# EAGLE design OXO (EAGLE 9.6.2)
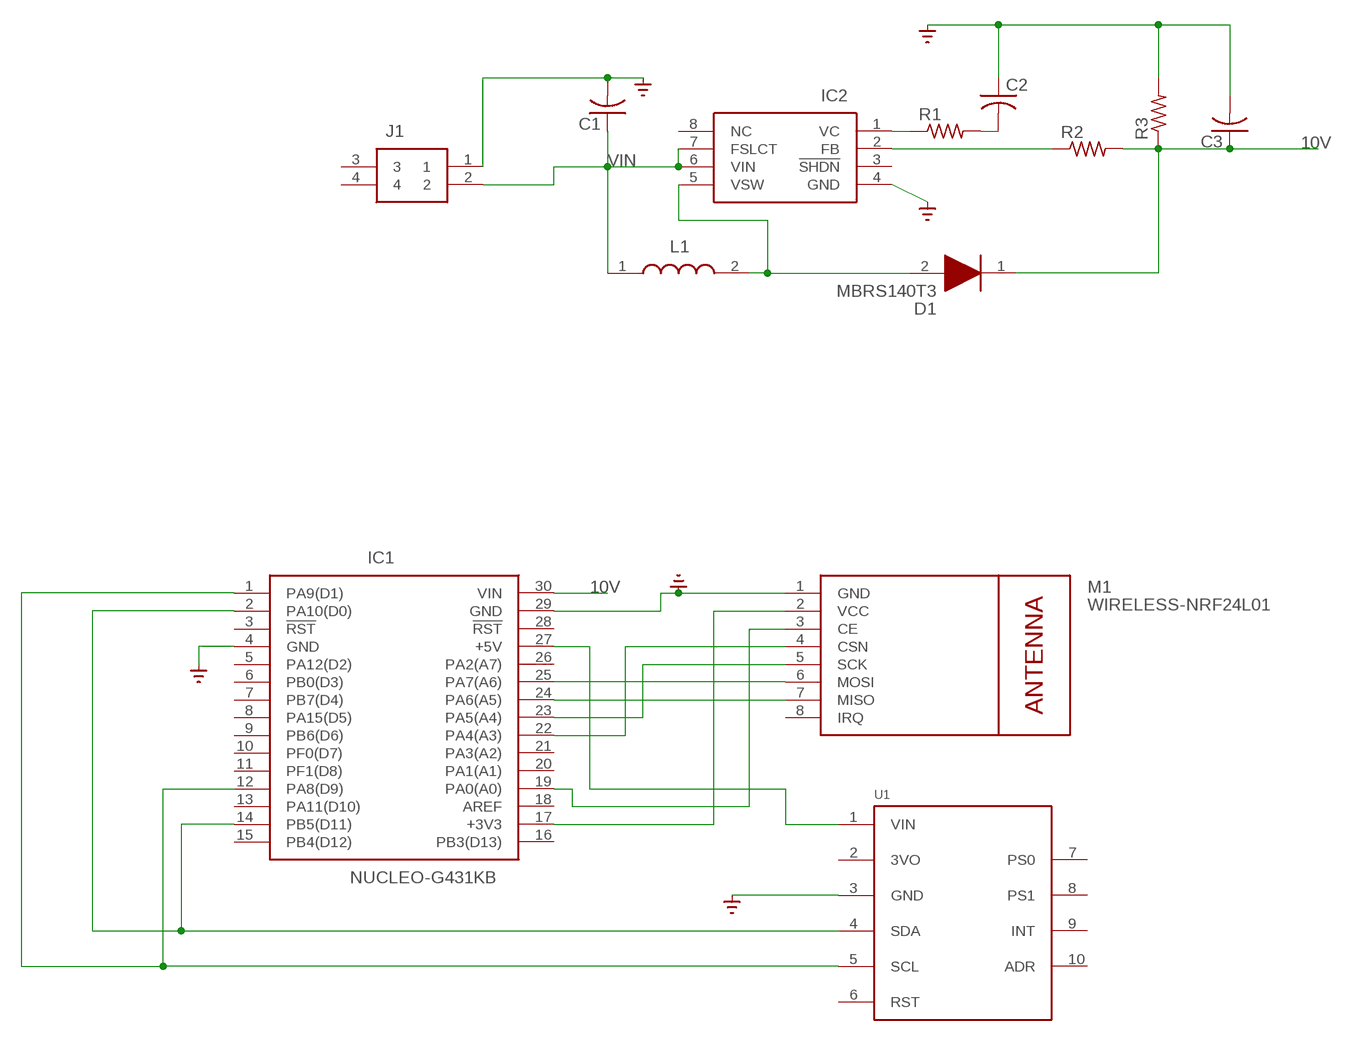
[diagram p0: schematic, sheet 1]

## Parts
C1  C-USC1206  [C1206]
C2  C-USC1206  [C1206]
C3  C-USC1206  [C1206]
D1  MBRS140T3  [DIOM5436X247N]
IC1  NUCLEO-G431KB  [DIPS1524W66P254L5029H1500Q30N]
IC2  LM2698MM-ADJ_NOPB  [SOP65P490X110-8N]
J1  53398-0271  [533980271]
L1  LQH3NPN100MMEL  [LQH3NPN100MMEL]
M1  WIRELESS-NRF24L01  [WIRELESS-NRF24L01]
R1  R-US_R1206  [R1206]
R2  R-US_R1206  [R1206]
R3  R-US_R1206  [R1206]
U1  ADADRUIT-BNO055  [ADAFRUIT-BNO055]

## Nets
10V: C3.1 D1.1(K) IC1.30(VIN) R2.2 R3.1
GND: C1.2 C2.1 C3.2 IC1.4(GND) IC1.29(GND) IC2.4(GND) J1.1 M1.1(GND) R3.2 U1.3(GND) ; supply symbol labelled SUPPLY0_GND_
N$2: IC1.17(+3V3) M1.2(VCC)
N$3: IC1.22(PA4(A3)) M1.4(CSN)
N$4: IC1.23(PA5(A4)) M1.5(SCK)
N$5: IC1.24(PA6(A5)) M1.7(MISO)
N$6: IC1.25(PA7(A6)) M1.6(MOSI)
N$7: IC1.27(+5V) U1.1(VIN)
N$10: IC1.1(PA9(D1)) IC1.12(PA8(D9)) U1.5(SCL)
N$11: IC1.2(PA10(D0)) IC1.14(PB5(D11)) U1.4(SDA)
N$12: IC1.19(PA0(A0)) M1.3(CE)
N$14: IC2.1(VC) R1.1
N$15: C2.2 R1.2
N$16: IC2.2(FB) R2.1
N$18: D1.2(A) IC2.5(VSW) L1.2
VIN: C1.1 IC2.6(VIN) IC2.7(FSLCT) J1.2 L1.1
Unconnected: IC1.3(!RST) IC1.5(PA12(D2)) IC1.6(PB0(D3)) IC1.7(PB7(D4)) IC1.8(PA15(D5)) IC1.9(PB6(D6)) IC1.10(PF0(D7)) IC1.11(PF1(D8)) IC1.13(PA11(D10)) IC1.15(PB4(D12)) IC1.16(PB3(D13)) IC1.18(AREF) IC1.20(PA1(A1)) IC1.21(PA3(A2)) IC1.26(PA2(A7)) IC1.28(!RST) IC2.3(!SHDN) IC2.8(NC) J1.3 J1.4 M1.8(IRQ) U1.6(RST) U1.7(PS0) U1.8(PS1) U1.9(INT) U1.10(ADR)

## Power pins joined to a net without a drawn wire
3VO: U1.2(3VO)

## Library data of the parts
C1-C3 = adafruit:C-US: CAPACITOR, American symbol
D1 = SamacSys_Parts2:MBRS140T3: Schottky Diodes & Rectifiers 1A 40V Source: Datasheet <https://componentsearchengine.com/Datasheets/1/MBRS140T3G.pdf>; DESCRIPTION: Schottky Diodes & Rectifiers 1A 40V; HEIGHT: 2.47mm; MANUFACTURER_NAME: ON Semiconductor; MANUFACTURER_PART_NUMBER: MBRS140T3; MOUSER_PART_NUMBER: 863-MBRS140T3; MOUSER_PRICE-STOCK: https://www.mouser.co.uk/ProductDetail/ON-Semiconductor/MBRS140T3?qs=3JMERSakebr8TMJvlb5wHg%3D%3D
IC1 = NUCLEO-G431KB:NUCLEO-G431KB: STM32 Nucleo-32 development board Source: Datasheet <http://www.st.com/content/ccc/resource/technical/document/data_brief/b1/d8/13/d4/b0/b7/4b/6e/DM00214578.pdf/files/DM00214578.pdf/jcr:content/translations/en.DM00214578.pdf>; ARROW_PART_NUMBER: NUCLEO-F303K8; ARROW_PRICE-STOCK: https://www.arrow.com/en/products/nucleo-f303k8/stmicroelectronics; DESCRIPTION: STM32 Nucleo-32 development board; HEIGHT: 15mm; MANUFACTURER_NAME: STMicroelectronics; MANUFACTURER_PART_NUMBER: NUCLEO-F303K8; RS_PART_NUMBER: 9092862; RS_PRICE-STOCK: http://uk.rs-online.com/web/p/products/9092862
IC2 = SamacSys_Parts2:LM2698MM-ADJ_NOPB: SIMPLE SWITCHER® 1.35A Boost Regulator Source: Datasheet <http://www.ti.com/lit/ds/symlink/lm2698.pdf>; ARROW_PART_NUMBER: LM2698MM-ADJ/NOPB; ARROW_PRICE-STOCK: https://www.arrow.com/en/products/lm2698mm-adjnopb/texas-instruments; DESCRIPTION: SIMPLE SWITCHER&#174; 1.35A Boost Regulator; HEIGHT: 1.1mm; MANUFACTURER_NAME: Texas Instruments; MANUFACTURER_PART_NUMBER: LM2698MM-ADJ/NOPB; MOUSER_PART_NUMBER: 926-LM2698MM-ADJNOPB; MOUSER_PRICE-STOCK: https://www.mouser.co.uk/ProductDetail/Texas-Instruments/LM2698MM-ADJ-NOPB?qs=X1J7HmVL2ZGrlnasHzxFGA%3D%3D
J1 = SamacSys_Parts2:53398-0271: 2 way straight SMT header,1.25mm pitch Molex PICOBLADE Series, Series Number 53398, 1.25mm Pitch 2 Way 1 Row Straight PCB Header, Solder Termination, 1A Source: Datasheet <http://www.molex.com/webdocs/datasheets/pdf/en-us//0533980271_PCB_HEADERS.pdf>; ARROW_PART_NUMBER: 53398-0271; ARROW_PRICE-STOCK: https://www.arrow.com/en/products/53398-0271/molex; DESCRIPTION: 2 way straight SMT header,1.25mm pitch Molex PICOBLADE Series, Series Number 53398, 1.25mm Pitch 2 Way 1 Row Straight PCB Header, Solder Termination, 1A; HEIGHT: 4.9mm; MANUFACTURER_NAME: Molex; MANUFACTURER_PART_NUMBER: 53398-0271; MOUSER_PART_NUMBER: 538-53398-0271; MOUSER_PRICE-STOCK: https://www.mouser.co.uk/ProductDetail/Molex/53398-0271?qs=yqtfsgZKt1Q75bA%252B4OtvRg%3D%3D
L1 = SamacSys_Parts2:LQH3NPN100MMEL: Fixed Inductors 10uH 1280mA 0.228ohm SRF=20MHz(min) Source: Datasheet <https://psearch.en.murata.com/inductor/product/LQH3NPN100MME#.html>; ARROW_PART_NUMBER: LQH3NPN100MMEL; ARROW_PRICE-STOCK: https://www.arrow.com/en/products/lqh3npn100mmel/murata-manufacturing; DESCRIPTION: Fixed Inductors 10uH 1280mA 0.228ohm SRF=20MHz(min); HEIGHT: 1.5mm; MANUFACTURER_NAME: Murata Electronics; MANUFACTURER_PART_NUMBER: LQH3NPN100MMEL; MOUSER_PART_NUMBER: 81-LQH3NPN100MMEL; MOUSER_PRICE-STOCK: https://www.mouser.co.uk/ProductDetail/Murata-Electronics/LQH3NPN100MMEL?qs=sJ5gq5MLFXowmwE0TDL8SQ%3D%3D
M1 = diy-modules:WIRELESS-NRF24L01: 2.4 GHz Wireless Module based on NRF24L01 chip More details available here: http://www.electrodragon.com/w/NRF24L01 Click here to find device on ebay.com <http://www.ebay.com/sch/nrf24l01+arduino>
R1-R3 = resistor:R-US_: RESISTOR, American symbol
U1 = BNO055:ADADRUIT-BNO055

## Board
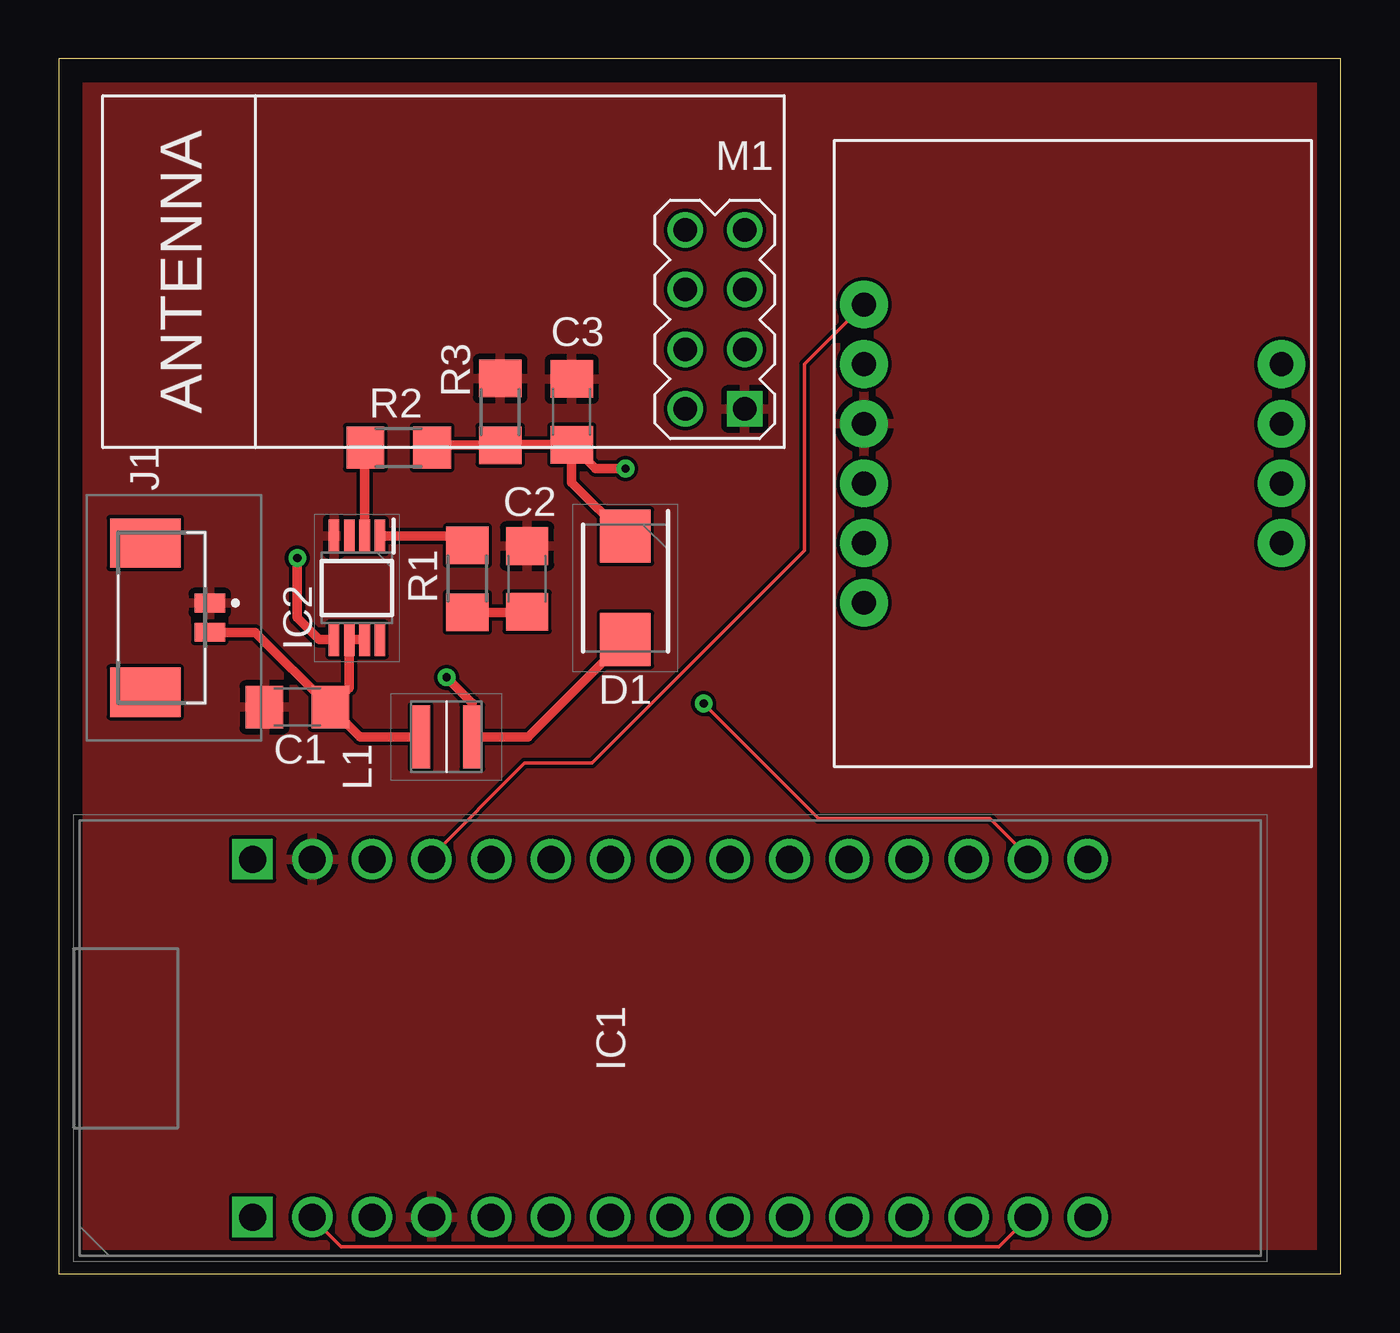
[diagram p1: board, top side]
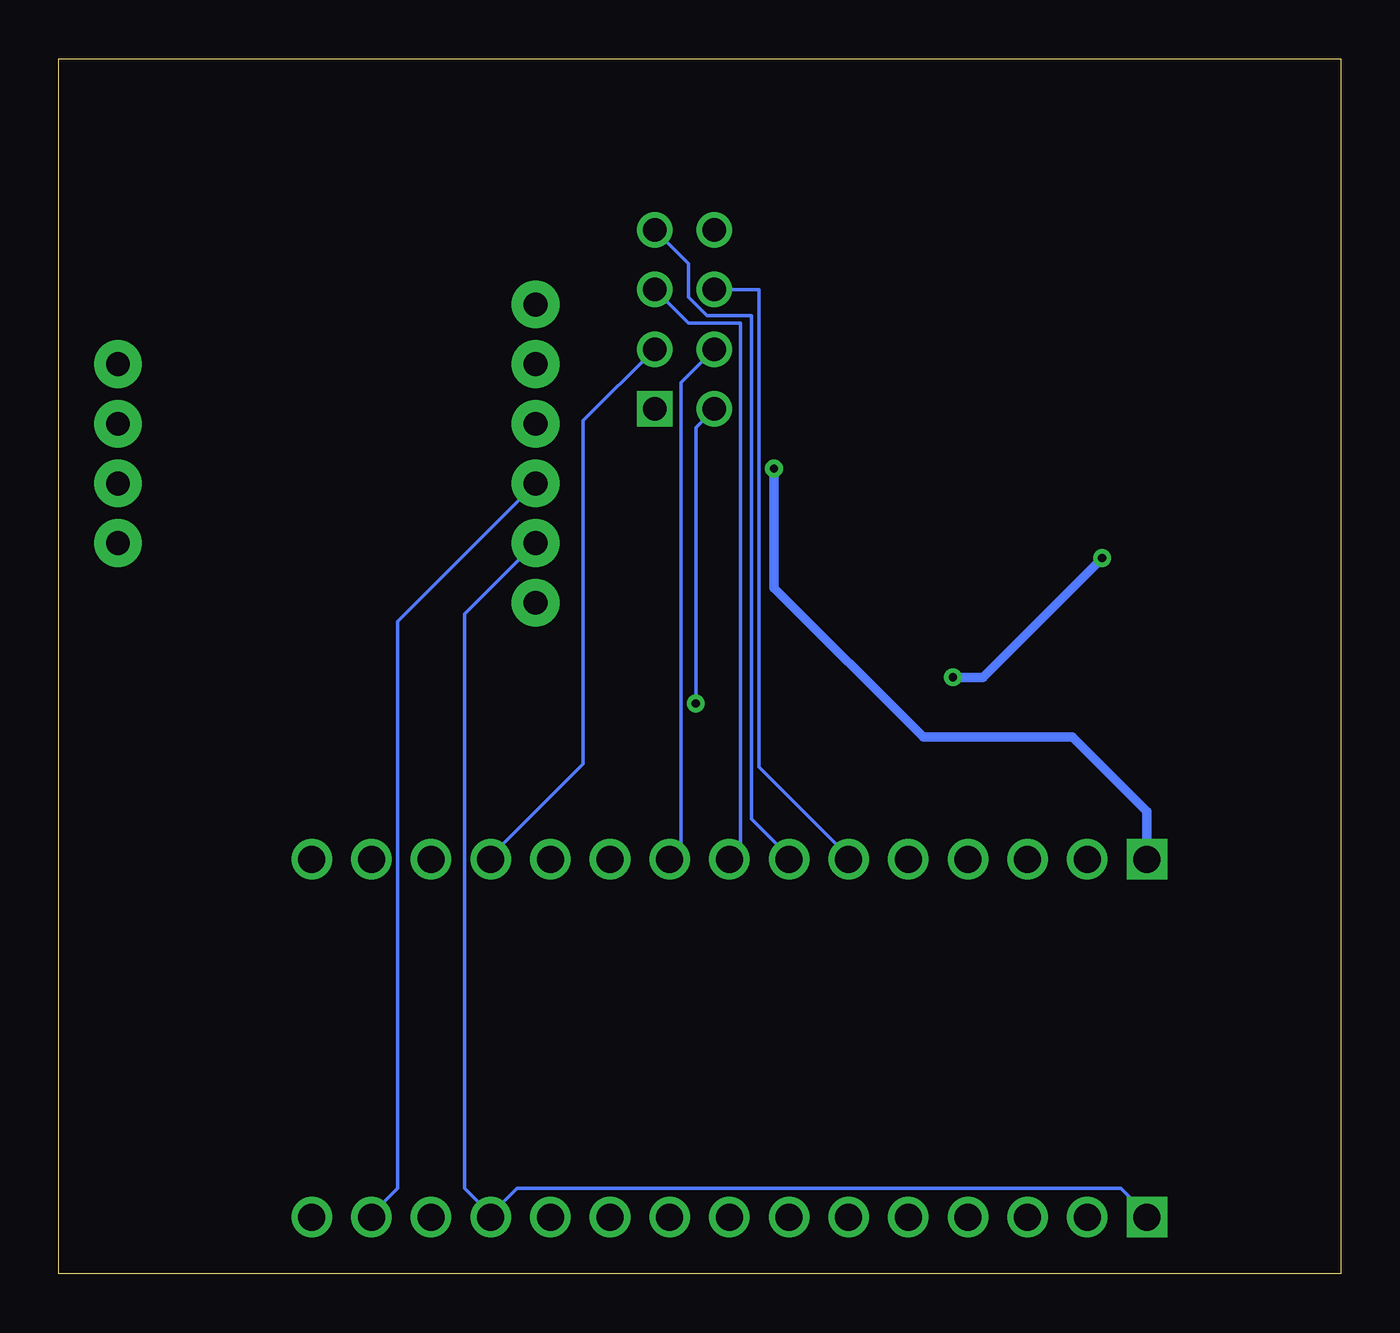
[diagram p2: board, bottom side, seen from below]

Size 54.59 x 51.74 mm. Coordinates in mm from the lower left corner, seen from the top.
Outline: 0,0 54.59,0 54.59,51.74 0,51.74 0,0
Copper layers (1*16): Top 0.035mm / dielectric 1.5mm / Bottom 0.035mm
Design rules "default": minimum track width 6mil, minimum drill 0.35mm, track to track 6mil, track to pad 6mil, pad to pad 6mil, via to via 6mil, smd to smd 6mil, copper to edge 40mil, drill to drill 6mil, minimum pad ring 10mil, minimum via ring 8mil, stop-mask expansion 4mil, vias tented up to drill 0mil, thermal gap 10mil

### Footprints (pad centres in the part's own frame; a part is rotated, then mirrored left to right if it is on the bottom)
C1206 = smd 1.6 x 1.8: 1 -1.4,0; 2 1.4,0
DIOM5436X247N = smd 2.25 x 2.15: 1 -2.2,0; 2 2.2,0
DIPS1524W66P254L5029H1500Q30N = drill 1.15 pad 1.725 square: 1 -7.62,17.78; 30 7.62,17.78 | drill 1.15 pad 1.725: 2 -7.62,15.24; 3 -7.62,12.7; 4 -7.62,10.16; 5 -7.62,7.62; 6 -7.62,5.08; 7 -7.62,2.54; 8 -7.62,0; 9 -7.62,-2.54; 10 -7.62,-5.08; 11 -7.62,-7.62; 12 -7.62,-10.16; 13 -7.62,-12.7; 14 -7.62,-15.24; 15 -7.62,-17.78; 16 7.62,-17.78; 17 7.62,-15.24; 18 7.62,-12.7; 19 7.62,-10.16; 20 7.62,-7.62; 21 7.62,-5.08; 22 7.62,-2.54; 23 7.62,0; 24 7.62,2.54; 25 7.62,5.08; 26 7.62,7.62; 27 7.62,10.16; 28 7.62,12.7; 29 7.62,15.24
SOP65P490X110-8N = smd 1.4 x 0.45: 1 -2.2,0.975; 2 -2.2,0.325; 3 -2.2,-0.325; 4 -2.2,-0.975; 5 2.2,-0.975; 6 2.2,-0.325; 7 2.2,0.325; 8 2.2,0.975
533980271 = smd 0.8 x 1.3: 1 -0.625,1.357; 2 0.625,1.357 | smd 2.1 x 3: 3 -3.175,-1.393; 4 3.175,-1.393
LQH3NPN100MMEL = smd 0.8 x 2.7: 1 -1.1,0; 2 1.1,0
WIRELESS-NRF24L01 = drill 1 square: 1 -12.7,6.35 | drill 1: 2 -10.16,6.35; 3 -12.7,3.81; 4 -10.16,3.81; 5 -12.7,1.27; 6 -10.16,1.27; 7 -12.7,-1.27; 8 -10.16,-1.27
R1206 = smd 1.6 x 1.803: 1 -1.422,0; 2 1.422,0
ADAFRUIT-BNO055 = drill 1.016 pad 2.032: 1 6.985,1.27; 2 9.525,1.27; 3 12.065,1.27; 4 14.605,1.27; 5 17.145,1.27; 6 19.685,1.27; 7 9.525,19.05; 8 12.065,19.05; 9 14.605,19.05; 10 17.145,19.05

### Placement (x,y rotation side)
C1  10.16,24.13 180 top
C2  19.94,29.59 270 top
C3  21.84,36.7 90 top
D1  24.13,29.21 270 top
IC1  26.04,10.03 90 top
IC2  12.7,29.21 270 top
J1  5.08,27.94 270 top
L1  16.51,22.86 0 top
M1  16.51,43.18 180 top
R1  17.4,29.59 270 top
R2  14.48,35.18 0 top
R3  18.8,36.7 90 top
U1  33.02,48.26 270 top

### Tracks (layer width: path | path; a pad name or v marks a point on that pad's centre or on a via)
10V  (via drill 0.35)
  Top 0.406: R2.2 16,35.28 R3.1 18.82,35.3 C3.1 | D1.1 21.84,33.7 C3.1 | C3.1 22.86,34.29 v24.13,34.29
  Bottom 0.406: v24.13,34.29 24.13,29.21 17.78,22.86 11.43,22.86 8.26,19.68 IC1.30
GND
  pour Top: 0,52.07 0,0 54.61,0 54.61,52.07
N$2  (via drill 0.35)
  Top 0.152: v27.46,24.29 32.35,19.4 39.66,19.4 41.27,17.78 IC1.17
  Bottom 0.152: M1.2 27.46,36.04 v27.46,24.29
N$3
  Bottom 0.152: M1.4 28.1,37.94 28.1,18.26 28.57,17.78 IC1.22
N$4
  Bottom 0.152: M1.5 27.78,40.48 25.56,40.48 25.56,18.26 26.04,17.78 IC1.23
N$5
  Bottom 0.152: M1.7 27.78,43.02 27.78,41.59 26.99,40.8 25.08,40.8 25.08,19.37 23.5,17.78 IC1.24
N$6
  Bottom 0.152: M1.6 24.77,41.91 24.77,21.59 20.95,17.78 IC1.25
N$7
  Top 0.152: U1.1 31.75,38.73 31.75,30.8 22.7,21.75 19.84,21.75 15.88,17.78 IC1.27
N$10
  Top 0.152: 36.2,2.54 IC1.12
  Bottom 0.152: 36.2,2.54 35.08,3.65 9.37,3.65 8.26,2.54 IC1.1 | U1.5 37.31,28.1 37.31,3.65 36.2,2.54 | 36.2,2.54 IC1.12
N$11
  Top 0.152: IC1.2 10.79,2.38 12.03,1.14 40.04,1.14 41.27,2.38 IC1.14
  Bottom 0.152: U1.4 40.16,27.78 40.16,3.65 41.27,2.54 IC1.14
N$12
  Bottom 0.152: M1.3 32.26,36.32 32.26,21.72 36.2,17.78 IC1.19
N$14
  Top 0.406: IC2.1 17,31.41 R1.1
N$15
  Top 0.406: R1.2 19.92,28.17 C2.2
N$16
  Top 0.406: R2.1 13.03,35.11 IC2.2
N$18  (via drill 0.35)
  Top 0.406: D1.2 19.98,22.86 L1.2 17.61,24.3 v16.51,25.4 | v10.16,30.48 10.16,27.94 11.09,27.01 IC2.5
  Bottom 0.406: v16.51,25.4 15.24,25.4 v10.16,30.48
VIN
  Top 0.406: IC2.7 IC2.6 12.38,24.95 C1.1 | C1.1 12.83,22.86 L1.1 | C1.1 8.38,27.32 J1.2